# Altium project PCB_Project.PrjPcb
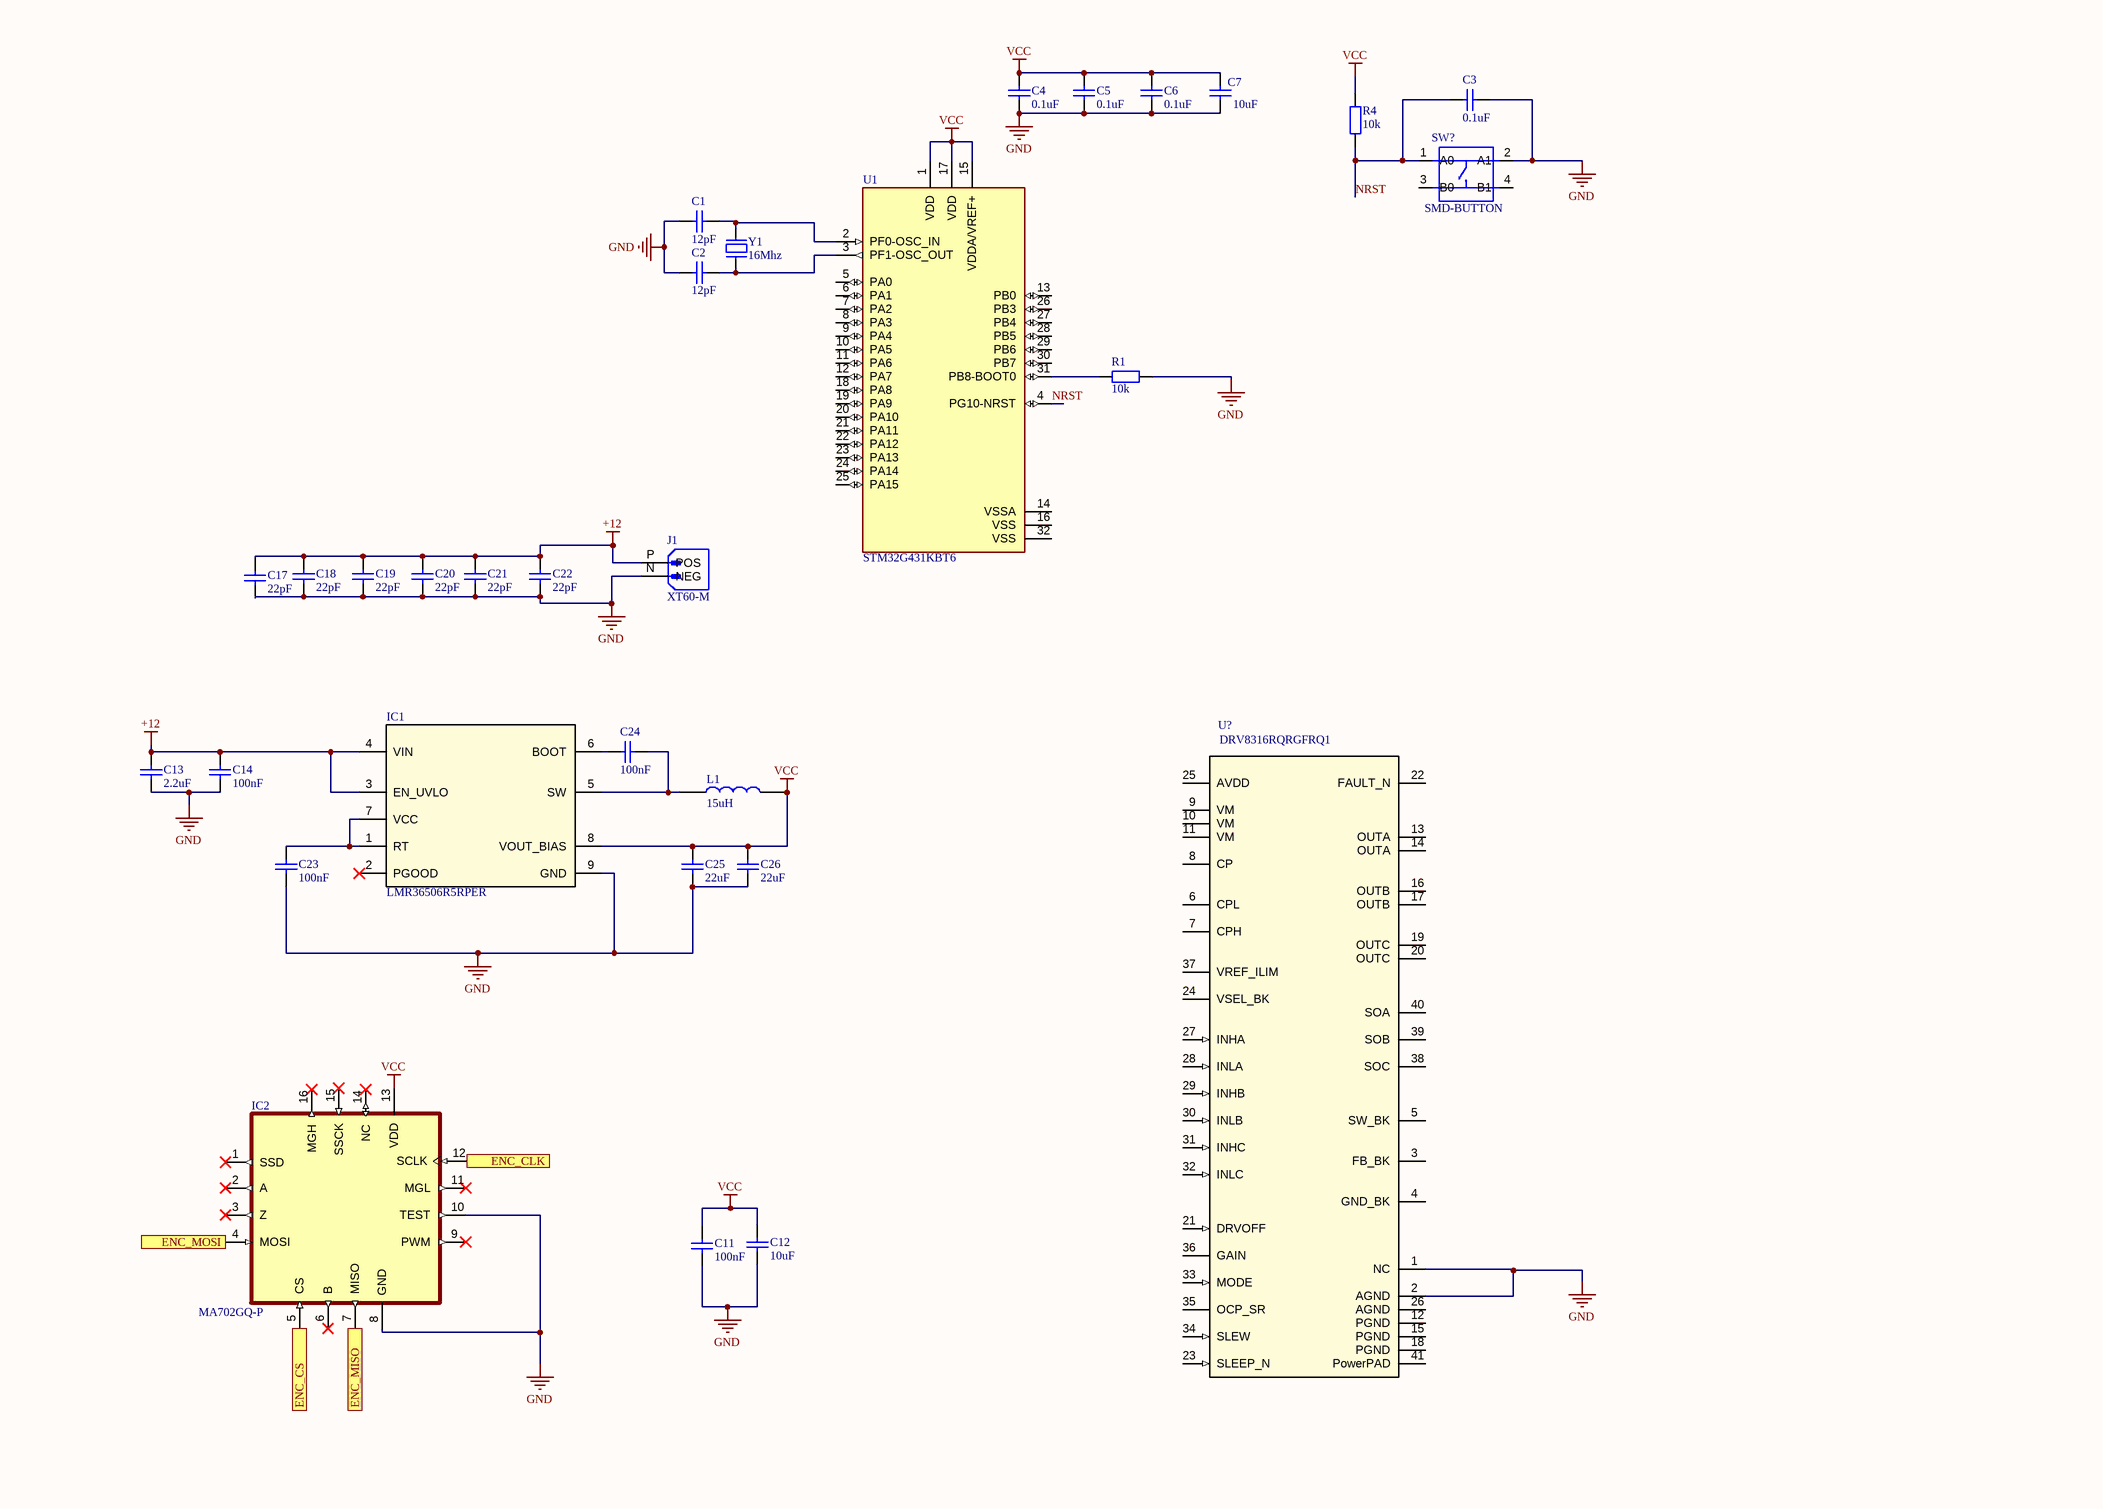
[diagram p0: Sheet1.SchDoc]
1 sheet, 31 parts. Net scope: flat (ports and power ports of the same name join across sheets).

## Sheet Sheet1.SchDoc
size A3; SheetNumber: 1; SheetTotal: 1

### Parts
C1  12pF  [tu 0603]
C2  12pF  [tu 0603]
C3  0.1uF  [tu 0603]
C4  0.1uF  [tu 0603]
C5  0.1uF  [tu 0603]
C6  0.1uF  [tu 0603]
C7  10uF  [tu 0603]
C11  100nF  [tu 1206]
C12  10uF  [tu 1206]
C13  2.2uF  [tu 0603]
C14  100nF  [tu 0805]
C17  22pF  [tu 0805]
C18  22pF  [tu 0805]
C19  22pF  [tu 0805]
C20  22pF  [tu 0805]
C21  22pF  [tu 0805]
C22  22pF  [tu 0805]
C23  100nF  [tu 0805]
C24  100nF  [tu 0805]
C25  22uF  [tu 1206]
C26  22uF  [tu 1206]
IC1  LMR36506R5RPER  [RPE0009A-MFG]
IC2  MA702GQ-P  [QFN50P300X300X100-17N]
J1  XT60-M  [AMASS_XT60-M]
L1  15uH  [Cuon Cam 7x7x5]
R1  10k  [tro smd 0603]
R4  10k  [tro smd 0603]
SW?  SMD-BUTTON  [SW4-SMD-5.2X5.2X1.5MM]
U1  STM32G431KBT6  [QFP80P900X900X160-32N]
U?  DRV8316RQRGFRQ1  [RGF0040E-IPC_A]
Y1  16Mhz  [Thach Anh 2 chan SMD5032]

### Ports
ENC_CLK, ENC_CS, ENC_MISO, ENC_MOSI

### Nets
+12: C13.1 C14.1 C17.1 C18.1 C19.1 C20.1 C21.1 C22.1 IC1.3(EN_UVLO) IC1.4(VIN) J1.P(POS)
GND: C1.2 C2.2 C3.2 C4.1 C5.1 C6.1 C7.1 C11.2 C12.2 C13.2 C14.2 C17.2 C18.2 C19.2 C20.2 C21.2 C22.2 C23.2 C25.2 C26.2 IC1.9(GND) IC2.8(GND) IC2.10(TEST) J1.N(NEG) R1.2 SW?.2(A1) U?.1(NC) U?.2(AGND)
VCC: C4.2 C5.2 C6.2 C7.2 C11.1 C12.1 C25.1 C26.1 IC1.8(VOUT_BIAS) IC2.13(VDD) L1.2 R4.2 U1.1(VDD) U1.15(VDDA/VREF+) U1.17(VDD)
NRST: C3.1 R4.1 SW?.1(A0) U1.4(PG10-NRST)
NetC1_1: C1.1 U1.2(PF0-OSC_IN) Y1.2
NetC2_1: C2.1 U1.3(PF1-OSC_OUT) Y1.1
NetC23_1: C23.1 IC1.1(RT) IC1.7(VCC)
NetC24_1: C24.1 IC1.6(BOOT)
NetC24_2: C24.2 IC1.5(SW) L1.1
NetIC2_4: IC2.4(MOSI) ; port ENC_MOSI
NetIC2_5: IC2.5(CS) ; port ENC_CS
NetIC2_7: IC2.7(MISO) ; port ENC_MISO
NetIC2_12: IC2.12(SCLK) ; port ENC_CLK
NetR1_1: R1.1 U1.31(PB8-BOOT0)

Not connected (* = marked no-connect by the designer): IC1 2(PGOOD)*; IC2 1(SSD)* 2(A)* 3(Z)* 6(B)* 9(PWM)* 11(MGL)* 14(NC)* 15(SSCK)* 16(MGH)*; SW? 3(B0) 4(B1); U1 5(PA0) 6(PA1) 7(PA2) 8(PA3) 9(PA4) 10(PA5) 11(PA6) 12(PA7) 13(PB0) 14(VSSA) 16(VSS) 18(PA8) 19(PA9) 20(PA10) 21(PA11) 22(PA12) 23(PA13) 24(PA14) 25(PA15) 26(PB3) 27(PB4) 28(PB5) 29(PB6) 30(PB7) 32(VSS); U? 3(FB_BK) 4(GND_BK) 5(SW_BK) 6(CPL) 7(CPH) 8(CP) 9(VM) 10(VM) 11(VM) 12(PGND) 13(OUTA) 14(OUTA) 15(PGND) 16(OUTB) 17(OUTB) 18(PGND) 19(OUTC) 20(OUTC) 21(DRVOFF) 22(FAULT_N) 23(SLEEP_N) 24(VSEL_BK) 25(AVDD) 26(AGND) 27(INHA) 28(INLA) 29(INHB) 30(INLB) 31(INHC) 32(INLC) 33(MODE) 34(SLEW) 35(OCP_SR) 36(GAIN) 37(VREF_ILIM) 38(SOC) 39(SOB) 40(SOA) 41(PowerPAD)

### Notes on the sheet
- DWG. NO.
- REV.
- SHT.
- THIS DOCUMENT AND THE DATA DISCLOSED HEREIN OR HEREWITH IS THE PROPERTY OF ALTIUM LIMITED AND MAY BE FREELY DISTRIBUTED IN WHOLE. NO RIGHTS ARE RESERVED OR EXPRESS OR IMPLIED WARANTEE GIVEN.
- REVISION
- DESCRIPTION
- DATE
- APPROVED
- ENG:
- APPROVALS
- PROJECT
- DSN:
- CHK:
- REFERENCE DOCUMENTS
- PROJECT REVISION:
- TITLE
- DOCUMENT REVISION:
- DESIGN ITEM:
- BOM:
- FAB DWG:
- PCB DWG:
- ASSY DWG:
- SCALE:
- SIZE
- B
- CAGE CODE
- FILE NAME
- DWG NO.
- SHEET
- OF
- REV

### Library data of the parts
C1-C7 = Tu 0603 101 50V 10%: Dán; Don_Vi: Con; So_Chan: 2; Ten_Linh_Kien: Tụ 0603 101-0.1nF 10% 50V; Ma_Hang: MH004565; Chung_Loai: Dán; Kieu_Chan: *
C11 C12 C25 C26 = Tu 1206 22pF 50V 10%: Dán; Ma_Hang: MH004547; Don_Vi: Con; So_Chan: 2; Ten_Linh_Kien: Tụ 1206 22P 10% 50V; Chung_Loai: Dán; Kieu_Chan: *
C13 = Tu 0603 102 50V 10%: Dán; Don_Vi: Con; So_Chan: 2; Ten_Linh_Kien: Tụ 0603 102-1nF 10% 50V; Ma_Hang: MH004566; Chung_Loai: Dán; Kieu_Chan: *
C14 C17-C24 = Tu 0805 22pF 50V 10%: Dán; Don_Vi: Con; So_Chan: 2; Ten_Linh_Kien: Tụ 0805 22P 10% 50V; Ma_Hang: MH004560; Chung_Loai: Dán; Kieu_Chan: *
IC1 = LMR36506R5RPER: 3-V to 65-V, 0.6-A ultra-small synchronous buck converter with 4 Î¼A IQ 9-VQFN-HR -40 to 150; Manufacturer_Name: Texas Instruments; TYPE: TYPE; RefDes: RefDes; Copyright: Copyright (C) 2026 Ultra Librarian. All rights reserved.; Manufacturer_Part_Number: LMR36506R5RPER
IC2 = MA702GQ-P: MF: {'manufacturer': u'Monolithic Power'}; Package: None; Price: None; Value: *; MP: MA702GQ-P; Availability: Unavailable
J1 = XT60-M: MF: {'manufacturer': u'AMASS'}; Package: None; Price: None; Value: *; MP: XT60-M; Availability: Unavailable
L1 = CUON CAM 47uH SMD: Dán; Don_Vi: Con; Ma_Hang: MH004211; Ten_Linh_Kien: Cuộn Cảm 47uH 7x7x4MM CD74R; Ghi_Chu: *; Kieu_Chan: *; Chung_Loai: Dán
R1 R4 = Tro 0603 1% 10k: Dán; Don_Vi: Con; So_Chan: 2; Ten_Linh_Kien: Trở 0603 1% 10k; Ma_Hang: MH006333; Chung_Loai: Dán; Kieu_Chan: *
SW? = SMD-BUTTON(4P-5.2X5.2X1.5MM-SKQGADE010): MF: {'manufacturer': u'ALPS'}; Package: None; Price: None; Value: *; MP: SMD-BUTTON(4P-5.2X5.2X1.5MM-SKQGADE010); Availability: Unavailable
U1 = STM32G431KBT6: MF: {'manufacturer': u'STMicroelectronics'}; Package: None; Price: None; Value: *; MP: STM32G431KBT6; Availability: Unavailable
U? = DRV8316RQRGFRQ1: Automotive 40-V max 8-A peak three-phase motor driver with integrated current sensing 40-VQFN -40 to 125; Manufacturer_Name: Texas Instruments; TYPE: TYPE; RefDes: RefDes; Copyright: Copyright (C) 2026 Ultra Librarian. All rights reserved.; Manufacturer_Part_Number: DRV8316RQRGFRQ1
Y1 = Thach Anh 2 chan SMD 5032: Crystal For all Crystal 2pin.; Value: 4Mhz